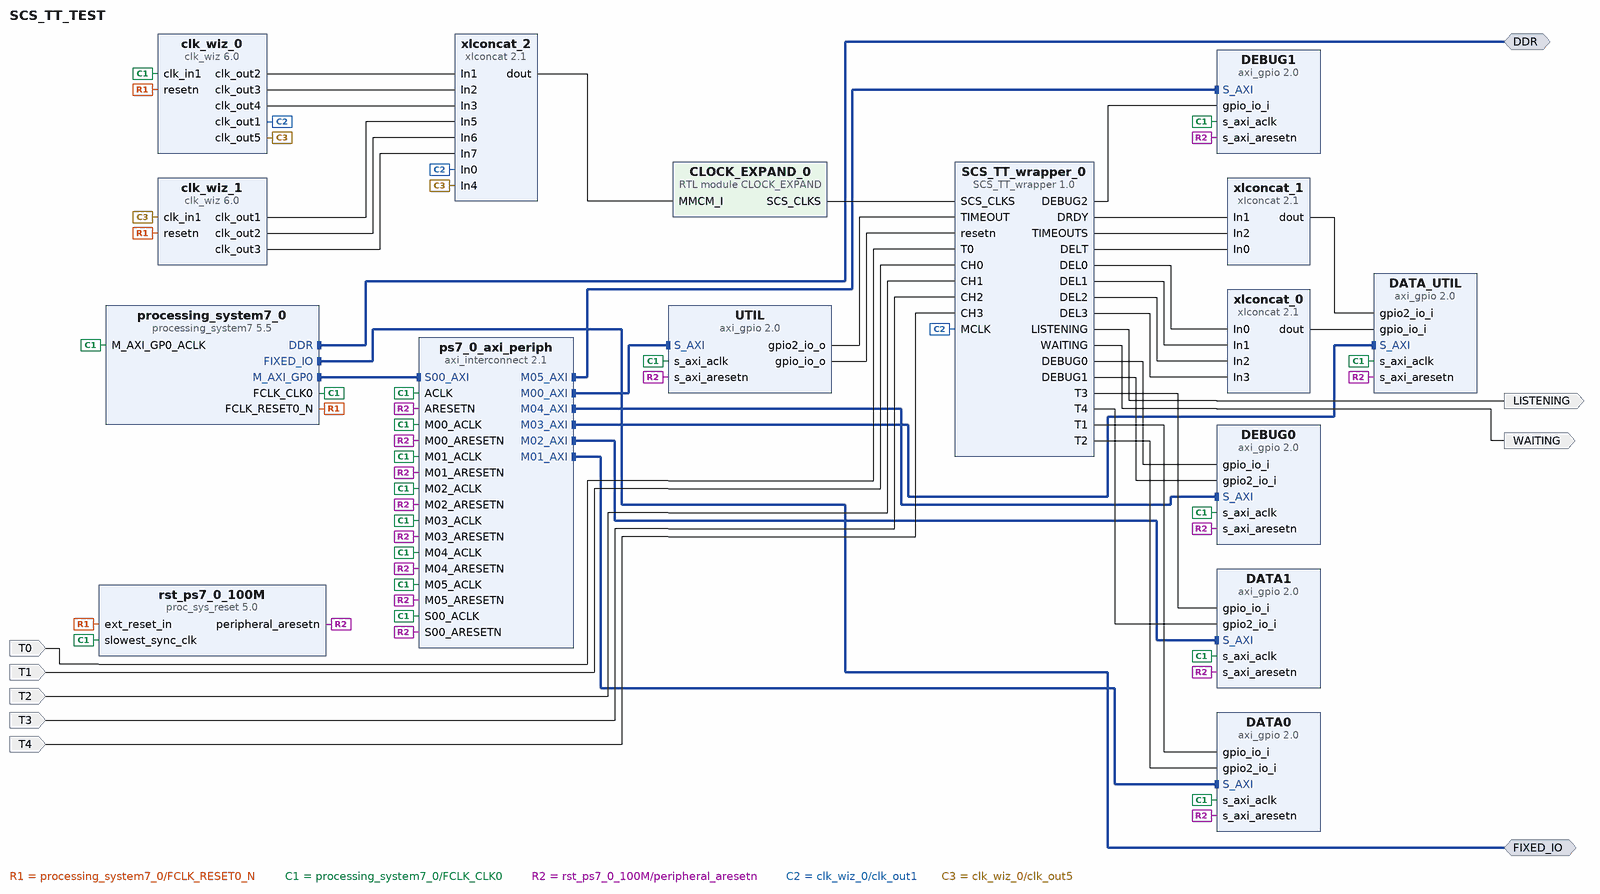
[diagram p0: block diagram of the top level]
# Vivado block design SCS_TT_TEST, xc7z020clg400-1, Vivado 2019.1
create_bd_design SCS_TT_TEST

create_bd_intf_port -mode Master -vlnv xilinx.com:interface:ddrx_rtl:1.0 DDR
create_bd_intf_port -mode Master -vlnv xilinx.com:display_processing_system7:fixedio_rtl:1.0 FIXED_IO
create_bd_port -dir I -type data T0
create_bd_port -dir I -type data T1
create_bd_port -dir I -type data T2
create_bd_port -dir I -type data T3
create_bd_port -dir I -type data T4
create_bd_port -dir O WAITING
create_bd_port -dir O LISTENING

create_bd_cell -type ip -vlnv xilinx.com:ip:processing_system7:5.5 processing_system7_0
set_property -dict [list \
  CONFIG.PCW_APU_PERIPHERAL_FREQMHZ 650 \
  CONFIG.PCW_CRYSTAL_PERIPHERAL_FREQMHZ 50 \
  CONFIG.PCW_ENET0_ENET0_IO {MIO 16 .. 27} \
  CONFIG.PCW_ENET0_GRP_MDIO_ENABLE 1 \
  CONFIG.PCW_ENET0_GRP_MDIO_IO {MIO 52 .. 53} \
  CONFIG.PCW_ENET0_PERIPHERAL_ENABLE 1 \
  CONFIG.PCW_ENET0_RESET_ENABLE 1 \
  CONFIG.PCW_ENET0_RESET_IO {MIO 9} \
  CONFIG.PCW_ENET_RESET_ENABLE 1 \
  CONFIG.PCW_ENET_RESET_SELECT {Share reset pin} \
  CONFIG.PCW_FPGA0_PERIPHERAL_FREQMHZ 100 \
  CONFIG.PCW_FPGA1_PERIPHERAL_FREQMHZ 50 \
  CONFIG.PCW_GPIO_MIO_GPIO_ENABLE 1 \
  CONFIG.PCW_GPIO_MIO_GPIO_IO MIO \
  CONFIG.PCW_I2C_RESET_ENABLE 1 \
  CONFIG.PCW_M_AXI_GP0_FREQMHZ 10 \
  CONFIG.PCW_PERIPHERAL_BOARD_PRESET None \
  CONFIG.PCW_PRESET_BANK1_VOLTAGE {LVCMOS 1.8V} \
  CONFIG.PCW_QSPI_GRP_FBCLK_ENABLE 1 \
  CONFIG.PCW_QSPI_GRP_FBCLK_IO {MIO 8} \
  CONFIG.PCW_QSPI_GRP_SINGLE_SS_ENABLE 1 \
  CONFIG.PCW_QSPI_GRP_SINGLE_SS_IO {MIO 1 .. 6} \
  CONFIG.PCW_QSPI_PERIPHERAL_ENABLE 1 \
  CONFIG.PCW_QSPI_QSPI_IO {MIO 1 .. 6} \
  CONFIG.PCW_SD0_GRP_CD_ENABLE 1 \
  CONFIG.PCW_SD0_GRP_CD_IO {MIO 47} \
  CONFIG.PCW_SD0_GRP_WP_ENABLE 0 \
  CONFIG.PCW_SD0_PERIPHERAL_ENABLE 1 \
  CONFIG.PCW_SD0_SD0_IO {MIO 40 .. 45} \
  CONFIG.PCW_SDIO_PERIPHERAL_FREQMHZ 50 \
  CONFIG.PCW_SINGLE_QSPI_DATA_MODE x4 \
  CONFIG.PCW_UART0_PERIPHERAL_ENABLE 1 \
  CONFIG.PCW_UART0_UART0_IO {MIO 14 .. 15} \
  CONFIG.PCW_UART1_PERIPHERAL_ENABLE 0 \
  CONFIG.PCW_UART_PERIPHERAL_FREQMHZ 100 \
  CONFIG.PCW_UIPARAM_DDR_BUS_WIDTH {16 Bit} \
  CONFIG.PCW_UIPARAM_DDR_FREQ_MHZ 525 \
  CONFIG.PCW_UIPARAM_DDR_PARTNO {MT41J256M16 RE-125} \
  CONFIG.PCW_USB0_PERIPHERAL_ENABLE 1 \
  CONFIG.PCW_USB0_RESET_ENABLE 1 \
  CONFIG.PCW_USB0_RESET_IO {MIO 46} \
  CONFIG.PCW_USB0_USB0_IO {MIO 28 .. 39} \
  CONFIG.PCW_USB_RESET_ENABLE 1 \
  CONFIG.PCW_USB_RESET_SELECT {Share reset pin} \
] [get_bd_cells processing_system7_0]
# 481 more settings of processing_system7_0 are not shown: defaults, MIO pin electricals, DDR timing, and values the tool derives
create_bd_cell -type ip -vlnv xilinx.com:ip:axi_gpio:2.0 UTIL
set_property -dict {CONFIG.C_ALL_OUTPUTS 1 CONFIG.C_ALL_OUTPUTS_2 1 CONFIG.C_GPIO_WIDTH 1 CONFIG.C_IS_DUAL 1} [get_bd_cells UTIL]
create_bd_cell -type ip -vlnv xilinx.com:ip:axi_gpio:2.0 DATA0
set_property -dict {CONFIG.C_ALL_INPUTS 1 CONFIG.C_ALL_INPUTS_2 1 CONFIG.C_IS_DUAL 1} [get_bd_cells DATA0]
create_bd_cell -type ip -vlnv xilinx.com:ip:axi_gpio:2.0 DATA1
set_property -dict {CONFIG.C_ALL_INPUTS 1 CONFIG.C_ALL_INPUTS_2 1 CONFIG.C_IS_DUAL 1} [get_bd_cells DATA1]
create_bd_cell -type ip -vlnv xilinx.com:ip:axi_gpio:2.0 DATA_UTIL
set_property -dict [list \
  CONFIG.C_ALL_INPUTS 1 \
  CONFIG.C_ALL_INPUTS_2 1 \
  CONFIG.C_GPIO2_WIDTH 13 \
  CONFIG.C_GPIO_WIDTH 32 \
  CONFIG.C_IS_DUAL 1 \
] [get_bd_cells DATA_UTIL]
create_bd_cell -type ip -vlnv xilinx.com:ip:xlconcat:2.1 xlconcat_0
set_property -dict [list \
  CONFIG.IN0_WIDTH 8 \
  CONFIG.IN1_WIDTH 8 \
  CONFIG.IN2_WIDTH 8 \
  CONFIG.IN3_WIDTH 8 \
  CONFIG.NUM_PORTS 4 \
] [get_bd_cells xlconcat_0]
create_bd_cell -type ip -vlnv xilinx.com:ip:xlconcat:2.1 xlconcat_1
set_property -dict {CONFIG.IN0_WIDTH 8 CONFIG.IN1_WIDTH 1 CONFIG.IN2_WIDTH 4 CONFIG.NUM_PORTS 3} [get_bd_cells xlconcat_1]
create_bd_cell -type ip -vlnv xilinx.com:ip:clk_wiz:6.0 clk_wiz_0
set_property -dict [list \
  CONFIG.CLKOUT1_DRIVES BUFG \
  CONFIG.CLKOUT1_JITTER 166.405 \
  CONFIG.CLKOUT1_PHASE_ERROR 313.695 \
  CONFIG.CLKOUT1_REQUESTED_OUT_FREQ 310 \
  CONFIG.CLKOUT2_DRIVES BUFG \
  CONFIG.CLKOUT2_JITTER 166.405 \
  CONFIG.CLKOUT2_PHASE_ERROR 313.695 \
  CONFIG.CLKOUT2_REQUESTED_OUT_FREQ 310 \
  CONFIG.CLKOUT2_REQUESTED_PHASE 22.5 \
  CONFIG.CLKOUT2_USED true \
  CONFIG.CLKOUT3_DRIVES BUFG \
  CONFIG.CLKOUT3_JITTER 166.405 \
  CONFIG.CLKOUT3_PHASE_ERROR 313.695 \
  CONFIG.CLKOUT3_REQUESTED_OUT_FREQ 310 \
  CONFIG.CLKOUT3_REQUESTED_PHASE 45 \
  CONFIG.CLKOUT3_USED true \
  CONFIG.CLKOUT4_DRIVES BUFG \
  CONFIG.CLKOUT4_JITTER 166.405 \
  CONFIG.CLKOUT4_PHASE_ERROR 313.695 \
  CONFIG.CLKOUT4_REQUESTED_OUT_FREQ 310 \
  CONFIG.CLKOUT4_REQUESTED_PHASE 67.5 \
  CONFIG.CLKOUT4_USED true \
  CONFIG.CLKOUT5_DRIVES BUFG \
  CONFIG.CLKOUT5_JITTER 166.405 \
  CONFIG.CLKOUT5_PHASE_ERROR 313.695 \
  CONFIG.CLKOUT5_REQUESTED_OUT_FREQ 310 \
  CONFIG.CLKOUT5_REQUESTED_PHASE 90 \
  CONFIG.CLKOUT5_USED true \
  CONFIG.CLKOUT6_DRIVES BUFG \
  CONFIG.CLKOUT7_DRIVES BUFG \
  CONFIG.JITTER_SEL Min_O_Jitter \
  CONFIG.MMCM_BANDWIDTH HIGH \
  CONFIG.MMCM_CLKFBOUT_MULT_F 62 \
  CONFIG.MMCM_CLKOUT0_DIVIDE_F 4 \
  CONFIG.MMCM_CLKOUT1_DIVIDE 4 \
  CONFIG.MMCM_CLKOUT1_PHASE 22.500 \
  CONFIG.MMCM_CLKOUT2_DIVIDE 4 \
  CONFIG.MMCM_CLKOUT2_PHASE 45.000 \
  CONFIG.MMCM_CLKOUT3_DIVIDE 4 \
  CONFIG.MMCM_CLKOUT3_PHASE 67.500 \
  CONFIG.MMCM_CLKOUT4_DIVIDE 4 \
  CONFIG.MMCM_CLKOUT4_PHASE 90.000 \
  CONFIG.MMCM_COMPENSATION ZHOLD \
  CONFIG.MMCM_DIVCLK_DIVIDE 5 \
  CONFIG.NUM_OUT_CLKS 5 \
  CONFIG.PRIMITIVE PLL \
  CONFIG.RESET_PORT resetn \
  CONFIG.RESET_TYPE ACTIVE_LOW \
  CONFIG.USE_LOCKED false \
] [get_bd_cells clk_wiz_0]
create_bd_cell -type ip -vlnv xilinx.com:ip:axi_interconnect:2.1 ps7_0_axi_periph
set_property -dict {CONFIG.NUM_MI 6} [get_bd_cells ps7_0_axi_periph]
create_bd_cell -type ip -vlnv xilinx.com:ip:proc_sys_reset:5.0 rst_ps7_0_100M
create_bd_cell -type ip -vlnv xilinx.com:ip:xlconcat:2.1 xlconcat_2
set_property -dict {CONFIG.NUM_PORTS 8} [get_bd_cells xlconcat_2]
create_bd_cell -type ip -vlnv xilinx.com:ip:clk_wiz:6.0 clk_wiz_1
set_property -dict [list \
  CONFIG.CLKIN1_JITTER_PS 32.25 \
  CONFIG.CLKOUT1_DRIVES BUFG \
  CONFIG.CLKOUT1_JITTER 85.994 \
  CONFIG.CLKOUT1_PHASE_ERROR 103.565 \
  CONFIG.CLKOUT1_REQUESTED_OUT_FREQ 310 \
  CONFIG.CLKOUT1_REQUESTED_PHASE 22.5 \
  CONFIG.CLKOUT2_DRIVES BUFG \
  CONFIG.CLKOUT2_JITTER 85.994 \
  CONFIG.CLKOUT2_PHASE_ERROR 103.565 \
  CONFIG.CLKOUT2_REQUESTED_OUT_FREQ 310 \
  CONFIG.CLKOUT2_REQUESTED_PHASE 45 \
  CONFIG.CLKOUT2_USED true \
  CONFIG.CLKOUT3_DRIVES BUFG \
  CONFIG.CLKOUT3_JITTER 85.994 \
  CONFIG.CLKOUT3_PHASE_ERROR 103.565 \
  CONFIG.CLKOUT3_REQUESTED_OUT_FREQ 310 \
  CONFIG.CLKOUT3_REQUESTED_PHASE 67.5 \
  CONFIG.CLKOUT3_USED true \
  CONFIG.CLKOUT4_DRIVES BUFG \
  CONFIG.CLKOUT4_JITTER 210.749 \
  CONFIG.CLKOUT4_PHASE_ERROR 303.235 \
  CONFIG.CLKOUT4_REQUESTED_OUT_FREQ 460 \
  CONFIG.CLKOUT4_REQUESTED_PHASE 90 \
  CONFIG.CLKOUT4_USED false \
  CONFIG.CLKOUT5_DRIVES BUFG \
  CONFIG.CLKOUT6_DRIVES BUFG \
  CONFIG.CLKOUT7_DRIVES BUFG \
  CONFIG.FEEDBACK_SOURCE FDBK_AUTO \
  CONFIG.MMCM_BANDWIDTH OPTIMIZED \
  CONFIG.MMCM_CLKFBOUT_MULT_F 2.000 \
  CONFIG.MMCM_CLKIN1_PERIOD 3.226 \
  CONFIG.MMCM_CLKIN2_PERIOD 10.0 \
  CONFIG.MMCM_CLKOUT0_DIVIDE_F 2.000 \
  CONFIG.MMCM_CLKOUT0_PHASE 22.500 \
  CONFIG.MMCM_CLKOUT1_DIVIDE 2 \
  CONFIG.MMCM_CLKOUT1_PHASE 45.000 \
  CONFIG.MMCM_CLKOUT2_DIVIDE 2 \
  CONFIG.MMCM_CLKOUT2_PHASE 67.500 \
  CONFIG.MMCM_CLKOUT3_DIVIDE 1 \
  CONFIG.MMCM_CLKOUT3_PHASE 90.000 \
  CONFIG.MMCM_COMPENSATION ZHOLD \
  CONFIG.MMCM_DIVCLK_DIVIDE 1 \
  CONFIG.NUM_OUT_CLKS 3 \
  CONFIG.PRIMITIVE MMCM \
  CONFIG.RESET_PORT resetn \
  CONFIG.RESET_TYPE ACTIVE_LOW \
  CONFIG.USE_LOCKED false \
] [get_bd_cells clk_wiz_1]
create_bd_cell -type module -reference CLOCK_EXPAND CLOCK_EXPAND_0
create_bd_cell -type ip -vlnv xilinx.com:ip:axi_gpio:2.0 DEBUG0
set_property -dict [list \
  CONFIG.C_ALL_INPUTS 1 \
  CONFIG.C_ALL_INPUTS_2 1 \
  CONFIG.C_GPIO2_WIDTH 32 \
  CONFIG.C_GPIO_WIDTH 32 \
  CONFIG.C_IS_DUAL 1 \
] [get_bd_cells DEBUG0]
create_bd_cell -type ip -vlnv xilinx.com:ip:axi_gpio:2.0 DEBUG1
set_property -dict {CONFIG.C_ALL_INPUTS 1 CONFIG.C_GPIO_WIDTH 16} [get_bd_cells DEBUG1]
create_bd_cell -type ip -vlnv cri.nz:user:SCS_TT_wrapper:1.0 SCS_TT_wrapper_0

# ---- connections ----

connect_bd_intf_net [get_bd_intf_ports DDR] [get_bd_intf_pins processing_system7_0/DDR]
connect_bd_intf_net [get_bd_intf_pins ps7_0_axi_periph/M02_AXI] [get_bd_intf_pins DATA1/S_AXI]
connect_bd_intf_net [get_bd_intf_ports FIXED_IO] [get_bd_intf_pins processing_system7_0/FIXED_IO]
connect_bd_intf_net [get_bd_intf_pins ps7_0_axi_periph/M04_AXI] [get_bd_intf_pins DEBUG0/S_AXI]
connect_bd_intf_net [get_bd_intf_pins ps7_0_axi_periph/M01_AXI] [get_bd_intf_pins DATA0/S_AXI]
connect_bd_intf_net [get_bd_intf_pins processing_system7_0/M_AXI_GP0] [get_bd_intf_pins ps7_0_axi_periph/S00_AXI]
connect_bd_intf_net [get_bd_intf_pins ps7_0_axi_periph/M00_AXI] [get_bd_intf_pins UTIL/S_AXI]
connect_bd_intf_net [get_bd_intf_pins ps7_0_axi_periph/M03_AXI] [get_bd_intf_pins DATA_UTIL/S_AXI]
connect_bd_intf_net [get_bd_intf_pins ps7_0_axi_periph/M05_AXI] [get_bd_intf_pins DEBUG1/S_AXI]
connect_bd_net [get_bd_pins xlconcat_0/dout] [get_bd_pins DATA_UTIL/gpio_io_i]
connect_bd_net [get_bd_pins xlconcat_1/dout] [get_bd_pins DATA_UTIL/gpio2_io_i]
connect_bd_net [get_bd_pins processing_system7_0/FCLK_RESET0_N] \
  [get_bd_pins clk_wiz_0/resetn] [get_bd_pins rst_ps7_0_100M/ext_reset_in] [get_bd_pins clk_wiz_1/resetn]
connect_bd_net [get_bd_pins processing_system7_0/FCLK_CLK0] \
  [get_bd_pins clk_wiz_0/clk_in1] [get_bd_pins processing_system7_0/M_AXI_GP0_ACLK] [get_bd_pins ps7_0_axi_periph/S00_ACLK] \
  [get_bd_pins rst_ps7_0_100M/slowest_sync_clk] [get_bd_pins UTIL/s_axi_aclk] [get_bd_pins ps7_0_axi_periph/M00_ACLK] \
  [get_bd_pins ps7_0_axi_periph/ACLK] [get_bd_pins DATA0/s_axi_aclk] [get_bd_pins ps7_0_axi_periph/M01_ACLK] \
  [get_bd_pins DATA1/s_axi_aclk] [get_bd_pins ps7_0_axi_periph/M02_ACLK] [get_bd_pins DATA_UTIL/s_axi_aclk] \
  [get_bd_pins ps7_0_axi_periph/M03_ACLK] [get_bd_pins DEBUG0/s_axi_aclk] [get_bd_pins ps7_0_axi_periph/M04_ACLK] \
  [get_bd_pins DEBUG1/s_axi_aclk] [get_bd_pins ps7_0_axi_periph/M05_ACLK]
connect_bd_net [get_bd_pins rst_ps7_0_100M/peripheral_aresetn] \
  [get_bd_pins ps7_0_axi_periph/S00_ARESETN] [get_bd_pins UTIL/s_axi_aresetn] [get_bd_pins ps7_0_axi_periph/M00_ARESETN] \
  [get_bd_pins ps7_0_axi_periph/ARESETN] [get_bd_pins DATA0/s_axi_aresetn] [get_bd_pins ps7_0_axi_periph/M01_ARESETN] \
  [get_bd_pins DATA1/s_axi_aresetn] [get_bd_pins ps7_0_axi_periph/M02_ARESETN] [get_bd_pins DATA_UTIL/s_axi_aresetn] \
  [get_bd_pins ps7_0_axi_periph/M03_ARESETN] [get_bd_pins DEBUG0/s_axi_aresetn] [get_bd_pins ps7_0_axi_periph/M04_ARESETN] \
  [get_bd_pins DEBUG1/s_axi_aresetn] [get_bd_pins ps7_0_axi_periph/M05_ARESETN]
connect_bd_net [get_bd_pins clk_wiz_0/clk_out1] [get_bd_pins xlconcat_2/In0] [get_bd_pins SCS_TT_wrapper_0/MCLK]
connect_bd_net [get_bd_pins clk_wiz_0/clk_out2] [get_bd_pins xlconcat_2/In1]
connect_bd_net [get_bd_pins clk_wiz_0/clk_out3] [get_bd_pins xlconcat_2/In2]
connect_bd_net [get_bd_pins clk_wiz_0/clk_out4] [get_bd_pins xlconcat_2/In3]
connect_bd_net [get_bd_pins xlconcat_2/dout] [get_bd_pins CLOCK_EXPAND_0/MMCM_I]
connect_bd_net [get_bd_pins clk_wiz_0/clk_out5] [get_bd_pins clk_wiz_1/clk_in1] [get_bd_pins xlconcat_2/In4]
connect_bd_net [get_bd_pins clk_wiz_1/clk_out1] [get_bd_pins xlconcat_2/In5]
connect_bd_net [get_bd_pins clk_wiz_1/clk_out2] [get_bd_pins xlconcat_2/In6]
connect_bd_net [get_bd_pins clk_wiz_1/clk_out3] [get_bd_pins xlconcat_2/In7]
connect_bd_net [get_bd_pins CLOCK_EXPAND_0/SCS_CLKS] [get_bd_pins SCS_TT_wrapper_0/SCS_CLKS]
connect_bd_net -net T0_1 [get_bd_ports T0] [get_bd_pins SCS_TT_wrapper_0/T0]
connect_bd_net -net T1_1 [get_bd_ports T1] [get_bd_pins SCS_TT_wrapper_0/CH0]
connect_bd_net -net T2_1 [get_bd_ports T2] [get_bd_pins SCS_TT_wrapper_0/CH1]
connect_bd_net -net T3_1 [get_bd_ports T3] [get_bd_pins SCS_TT_wrapper_0/CH2]
connect_bd_net -net T4_1 [get_bd_ports T4] [get_bd_pins SCS_TT_wrapper_0/CH3]
connect_bd_net [get_bd_pins UTIL/gpio2_io_o] [get_bd_pins SCS_TT_wrapper_0/TIMEOUT]
connect_bd_net [get_bd_pins SCS_TT_wrapper_0/T1] [get_bd_pins DATA0/gpio_io_i]
connect_bd_net [get_bd_pins SCS_TT_wrapper_0/T2] [get_bd_pins DATA0/gpio2_io_i]
connect_bd_net [get_bd_pins SCS_TT_wrapper_0/T3] [get_bd_pins DATA1/gpio_io_i]
connect_bd_net [get_bd_pins SCS_TT_wrapper_0/T4] [get_bd_pins DATA1/gpio2_io_i]
connect_bd_net [get_bd_pins SCS_TT_wrapper_0/DEL0] [get_bd_pins xlconcat_0/In0]
connect_bd_net [get_bd_pins SCS_TT_wrapper_0/DEL1] [get_bd_pins xlconcat_0/In1]
connect_bd_net [get_bd_pins SCS_TT_wrapper_0/DEL2] [get_bd_pins xlconcat_0/In2]
connect_bd_net [get_bd_pins SCS_TT_wrapper_0/DEL3] [get_bd_pins xlconcat_0/In3]
connect_bd_net [get_bd_pins SCS_TT_wrapper_0/LISTENING] [get_bd_ports LISTENING]
connect_bd_net [get_bd_pins SCS_TT_wrapper_0/WAITING] [get_bd_ports WAITING]
connect_bd_net [get_bd_pins SCS_TT_wrapper_0/DRDY] [get_bd_pins xlconcat_1/In1]
connect_bd_net [get_bd_pins SCS_TT_wrapper_0/TIMEOUTS] [get_bd_pins xlconcat_1/In2]
connect_bd_net [get_bd_pins SCS_TT_wrapper_0/DELT] [get_bd_pins xlconcat_1/In0]
connect_bd_net [get_bd_pins UTIL/gpio_io_o] [get_bd_pins SCS_TT_wrapper_0/resetn]
connect_bd_net [get_bd_pins SCS_TT_wrapper_0/DEBUG0] [get_bd_pins DEBUG0/gpio_io_i]
connect_bd_net [get_bd_pins SCS_TT_wrapper_0/DEBUG1] [get_bd_pins DEBUG0/gpio2_io_i]
connect_bd_net [get_bd_pins SCS_TT_wrapper_0/DEBUG2] [get_bd_pins DEBUG1/gpio_io_i]

# ---- address map ----
assign_bd_address -offset 0x41200000 -range 64K -target_address_space [get_bd_addr_spaces processing_system7_0/Data] [get_bd_addr_segs UTIL/S_AXI/Reg]
assign_bd_address -offset 0x41210000 -range 64K -target_address_space [get_bd_addr_spaces processing_system7_0/Data] [get_bd_addr_segs DATA0/S_AXI/Reg]
assign_bd_address -offset 0x41220000 -range 64K -target_address_space [get_bd_addr_spaces processing_system7_0/Data] [get_bd_addr_segs DATA1/S_AXI/Reg]
assign_bd_address -offset 0x41230000 -range 64K -target_address_space [get_bd_addr_spaces processing_system7_0/Data] [get_bd_addr_segs DATA_UTIL/S_AXI/Reg]
assign_bd_address -offset 0x41240000 -range 64K -target_address_space [get_bd_addr_spaces processing_system7_0/Data] [get_bd_addr_segs DEBUG0/S_AXI/Reg]
assign_bd_address -offset 0x41250000 -range 64K -target_address_space [get_bd_addr_spaces processing_system7_0/Data] [get_bd_addr_segs DEBUG1/S_AXI/Reg]

validate_bd_design
save_bd_design
